# Altium schematic sheet [04] - DOC REVISION HISTORY.SchDoc
size A3; DocumentNumber: 4; SheetNumber: 4; SheetTotal: 4; Organization: Altium Limited; Address1: L3, 12a Rodborough Rd; Address2: Frenchs Forest; Address3: NSW; Address4: Australia 2086
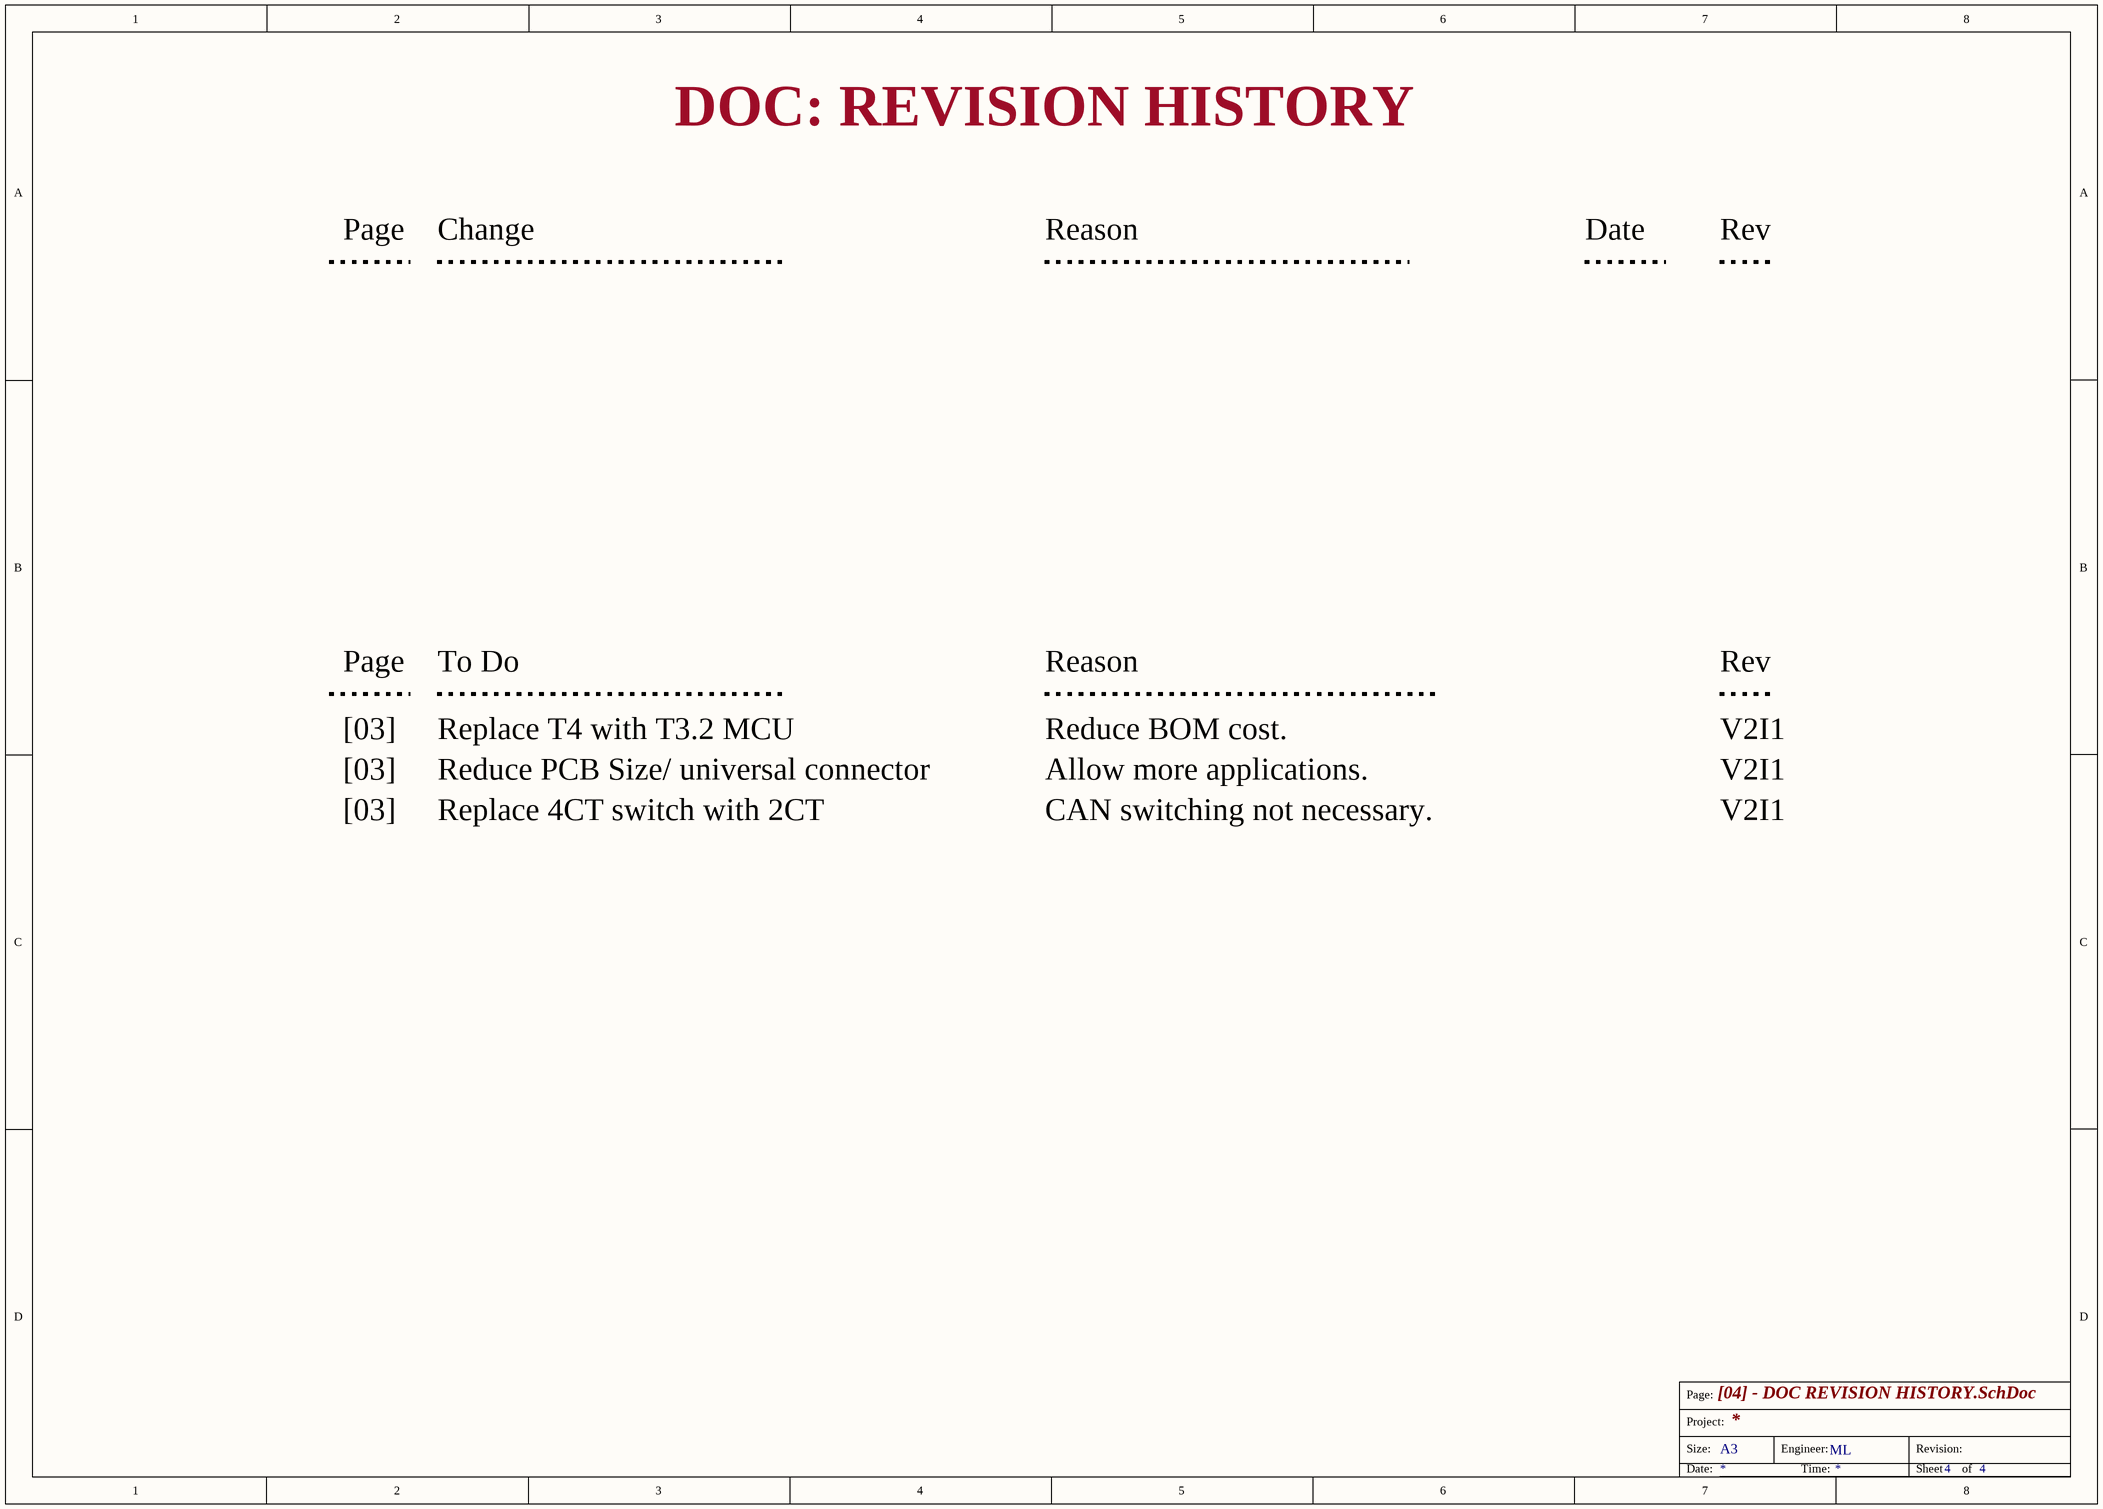
[diagram p0: [04] - DOC REVISION HISTORY.SchDoc]

## Notes on the sheet
- DOC: REVISION HISTORY
- Page
- Change
- Reason
- Date
- Rev
- To Do
- [03]
- Replace T4 with T3.2 MCU
- Reduce PCB Size/ universal connector
- Reduce BOM cost.
- Allow more applications.
- V2I1
- Replace 4CT switch with 2CT
- CAN switching not necessary.
- CLOCKS (CPU & PCIE)
- Page:
- Size:
- Project:
- A3
- Engineer:
- ML
- Revision:
- Date:
- Time:
- Sheet
- of